# Altium schematic sheet USB_PCIe.SchDoc: USB_PCIe
size A3; Date: Not used; ApprovedBy: Not used; CheckedBy: Not used; Author: Not used; CompanyName: STMicroelectronics; DrawnBy: Not used; Engineer: Not used; Organization: Not used; Address1: Not used; Address2: Not used; Address3: Not used; Address4: Not used; DocumentNumber: Not used; Revision: Not used; SheetNumber: 11; SheetTotal: 18; CurrentTime: Not used; CurrentDate: Not used; Time: Not used; DocumentFullPathAndName: Not used; DocumentName: Not used; ModifiedDate: Not used; ImagePath: Not used; ProjectName: Not used; Application_BuildNumber: Not used
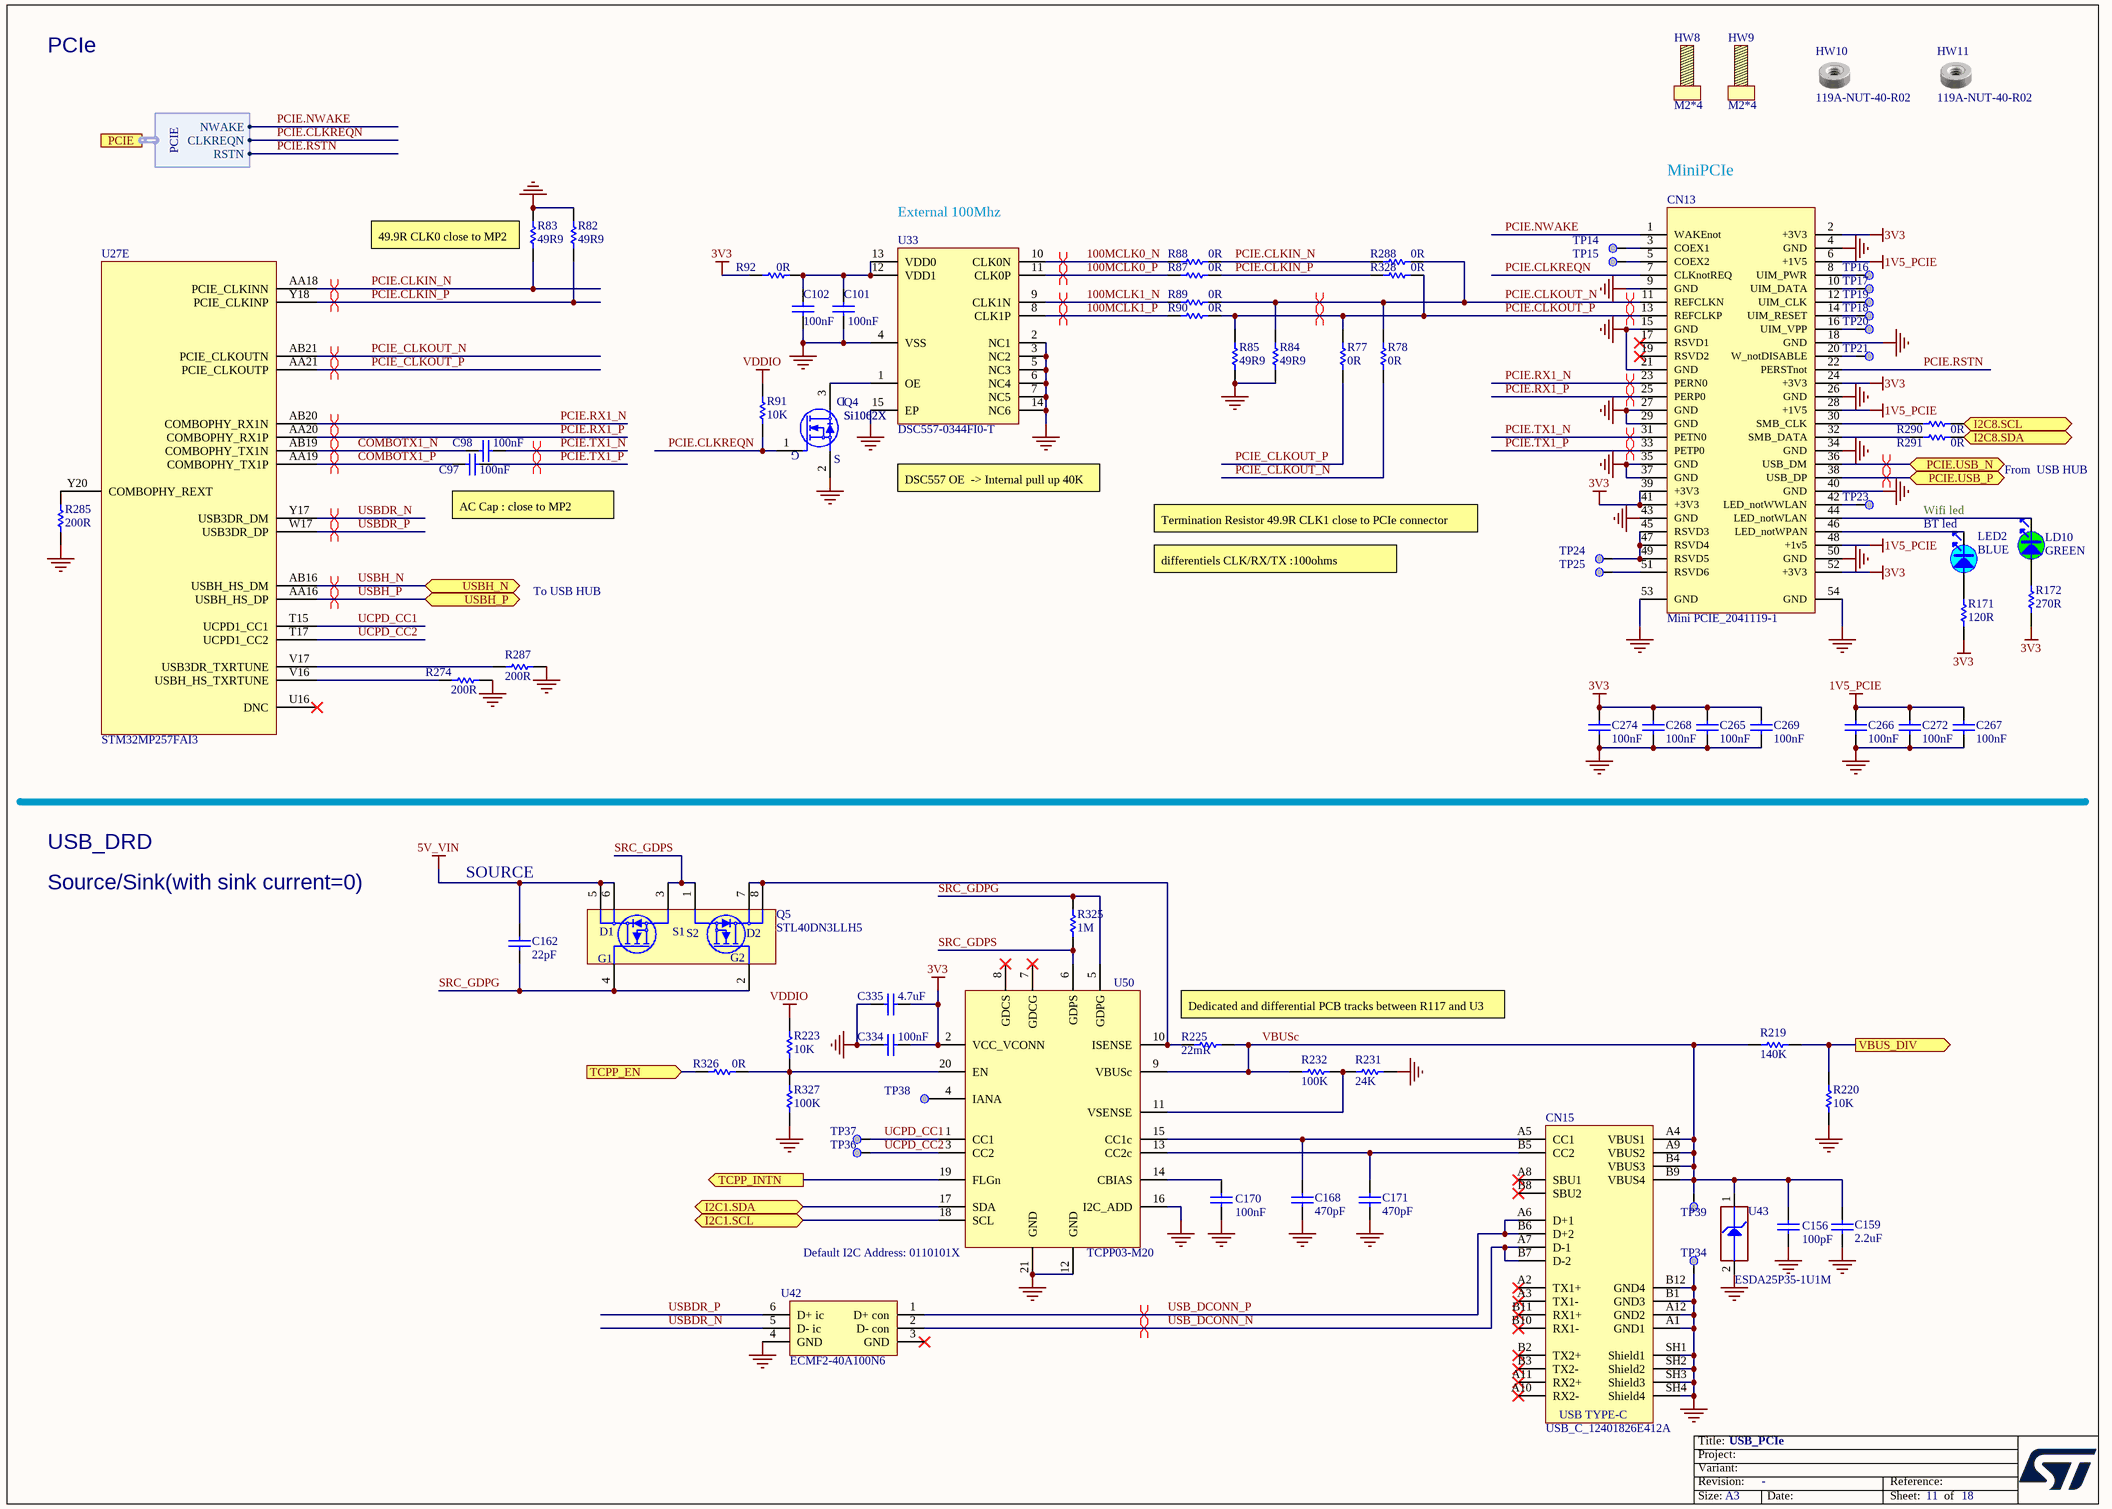
[diagram p0: USB_PCIe.SchDoc]

## Parts
C97  value 100nF  [C0201_MURATA_GRM033_H0P3]  (hidden comment: Capacitor)
C98  value 100nF  [C0201_MURATA_GRM033_H0P3]  (hidden comment: Capacitor)
C101  value 100nF  [C0402]  (hidden comment: Capacitor)
C102  value 100nF  [C0402]  (hidden comment: Capacitor)
C156  value 100pF  [C0402]  (hidden comment: Capacitor)
C159  value 2.2uF  [C0805]  (hidden comment: Capacitor)
C162  value 22pF  [C0402]  (hidden comment: Capacitor)
C168  value 470pF  [C0402]  (hidden comment: Capacitor)
C170  value 100nF  [C0603]  (hidden comment: Capacitor)
C171  value 470pF  [C0402]  (hidden comment: Capacitor)
C265  value 100nF  [C0201_H0P3]  (hidden comment: Capacitor)
C266  value 100nF  [C0201_H0P3]  (hidden comment: Capacitor)
C267  value 100nF  [C0201_H0P3]  (hidden comment: Capacitor)
C268  value 100nF  [C0201_H0P3]  (hidden comment: Capacitor)
C269  value 100nF  [C0201_H0P3]  (hidden comment: Capacitor)
C272  value 100nF  [C0201_H0P3]  (hidden comment: Capacitor)
C274  value 100nF  [C0201_H0P3]  (hidden comment: Capacitor)
C334  value 100nF  [C0402]  (hidden comment: Capacitor)
C335  value 4.7uF  [C0402]  (hidden comment: Capacitor)
CN13  value Mini PCIE_2041119-1  [CON_TE-CONNECTIVITY_2041119-1_HALF-CARD]  (hidden comment: SOCKET_Mini_PCIE)
CN15  value USB_C_12401826E412A  [CON_USB-TYPEC_AMPHENOL_12401826E412A]  (hidden comment: USB_TYPE_C_Receptacle)
HW8  value M2*4  (hidden comment: SCREW)  (mechanical)
HW9  value M2*4  (hidden comment: SCREW)  (mechanical)
HW10  value 119A-NUT-40-R02  [MISC_119A-NUT-40-R02]  (hidden comment: Standoff_mini_PCIE)  (mechanical)
HW11  value 119A-NUT-40-R02  [MISC_119A-NUT-40-R02]  (hidden comment: Standoff_mini_PCIE)  (mechanical)
LD10  value GREEN  [LED_0603_OSRAM_LG-Q396-PS-35_GREEN_1A2K_H0P4]  (hidden comment: LED_green)
LED2  value BLUE  [LED_0603_OSRAM_LB-Q39G-L2OO-35-1_BLUE_1A2K_H0P4]
Q4  value Si1062X  Manufacturer_Part_Number: Si1062X  [MOS_SC89-3L]  (hidden comment: MOSFET_N-CHANNEL)
Q5  STL40DN3LLH5  [PowerFLAT_5x6]
R77  value 0R  [R0402]  (hidden comment: Resistor)
R78  value 0R  [R0402]  (hidden comment: Resistor)
R82  value 49R9  [R0402]  (hidden comment: Resistor)
R83  value 49R9  [R0402]  (hidden comment: Resistor)
R84  value 49R9  [R0402]  (hidden comment: Resistor)
R85  value 49R9  [R0402]  (hidden comment: Resistor)
R87  value 0R  [R0402]  (hidden comment: Resistor)
R88  value 0R  [R0402]  (hidden comment: Resistor)
R89  value 0R  [R0402]  (hidden comment: Resistor)
R90  value 0R  [R0402]  (hidden comment: Resistor)
R91  value 10K  [R0402]  (hidden comment: Resistor)
R92  value 0R  [R0402]  (hidden comment: Resistor)
R171  value 120R  [R0402]
R172  value 270R  [R0402]  (hidden comment: Resistor)
R219  value 140K  [R0402]  (hidden comment: Resistor)
R220  value 10K  [R0402]  (hidden comment: Resistor)
R223  value 10K  [R0402]  (hidden comment: Resistor)
R225  value 22mR  [R0603]  (hidden comment: Resistor)
R231  value 24K  [R0402]  (hidden comment: Resistor)
R232  value 100K  [R0402]  (hidden comment: Resistor)
R274  value 200R  [R0402]  (hidden comment: Resistor)
R285  value 200R  [R0402]  (hidden comment: Resistor)
R287  value 200R  [R0402]  (hidden comment: Resistor)
R288  value 0R  [R0402]  (hidden comment: Resistor)
R290  value 0R  [R0402]  (hidden comment: Resistor)
R291  value 0R  [R0402]  (hidden comment: Resistor)
R325  value 1M  [R0402]  (hidden comment: Resistor)
R326  value 0R  [R0402]  (hidden comment: Resistor)
R327  value 100K  [R0402]  (hidden comment: Resistor)
R328  value 0R  [R0402]  (hidden comment: Resistor)
TP14  Test Point  [TP_SMD_1MM]  (value not drawn)  (no BOM)
TP15  Test Point  [TP_SMD_1MM]  (value not drawn)  (no BOM)
TP16  Test Point  [TP_SMD_1MM]  (value not drawn)  (no BOM)
TP17  Test Point  [TP_SMD_1MM]  (value not drawn)  (no BOM)
TP18  Test Point  [TP_SMD_1MM]  (value not drawn)  (no BOM)
TP19  Test Point  [TP_SMD_1MM]  (value not drawn)  (no BOM)
TP20  Test Point  [TP_SMD_1MM]  (value not drawn)  (no BOM)
TP21  Test Point  [TP_SMD_1MM]  (value not drawn)  (no BOM)
TP23  Test Point  [TP_SMD_1MM]  (value not drawn)  (no BOM)
TP24  Test Point  [TP_SMD_1MM]  (value not drawn)  (no BOM)
TP25  Test Point  [TP_SMD_1MM]  (value not drawn)  (no BOM)
TP34  Test Point  [TP_SMD_1MM]  (value not drawn)  (no BOM)
TP36  Test Point  [TP_SMD_1MM]  (value not drawn)  (no BOM)
TP37  Test Point  [TP_SMD_1MM]  (value not drawn)  (no BOM)
TP38  Test Point  [TP_SMD_1MM]  (value not drawn)  (no BOM)
TP39  Test Point  [TP_SMD_1MM]  (value not drawn)  (no BOM)
U27  STM32MP257FAI3  [ICC_LFBGA436_18X18_P080_H1P70_STM32MP257_CODE-B0D1]  (part E of 9)
U33  DSC557-0344FI0-T  [ICC_QFN14-EPAD_3P2X2P5_P050]
U42  ECMF2-40A100N6  [ESD_UQFN-6L_1P45X1P4_P040]
U43  value ESDA25P35-1U1M  [ESD_QFN1610_2N_1K_2A]  (hidden comment: ESD-TRANSIL)
U50  TCPP03-M20  [ICC_QFN20-EPAD_4X4_P050]

## Ports
I2C1.SCL (bidir), I2C1.SDA (bidir), I2C8.SCL (bidir), I2C8.SDA (bidir), PCIE (harness PCIE), PCIE.USB_N (bidir), PCIE.USB_P (bidir), TCPP_EN (in), TCPP_INTN (out), USBH_N (bidir), USBH_P (bidir), VBUS_DIV (out)

## Harnesses
PCIE: NWAKE, CLKREQN, RSTN

## Nets
1V5_PCIE: C266.1 C267.1 C272.1 CN13.6(+1V5) CN13.28(+1V5) CN13.48(+1v5)
3V3: C265.1 C268.1 C269.2 C274.1 C334.1 C335.1 CN13.2(+3V3) CN13.24(+3V3) CN13.39(+3V3) CN13.41(+3V3) CN13.52(+3V3) R92.1 R171.2 R172.1 U50.2(VCC_VCONN)
5V_VIN: C162.2 Q5.5(D1) Q5.6(D1)
GND: C101.1 C102.1 C156.1 C159.1 C168.1 C170.1 C171.1 C265.2 C266.2 C267.2 C268.2 C269.1 C272.2 C274.2 C334.2 C335.2 CN13.4(GND) CN13.9(GND) CN13.15(GND) CN13.18(GND) CN13.21(GND) CN13.26(GND) CN13.27(GND) CN13.29(GND) CN13.34(GND) CN13.35(GND) CN13.37(GND) CN13.40(GND) CN13.43(GND) CN13.50(GND) CN13.53(GND) CN13.54(GND) CN15.A1(GND1) CN15.A12(GND2) CN15.B1(GND3) CN15.B12(GND4) CN15.SH1(Shield1) CN15.SH2(Shield2) CN15.SH3(Shield3) CN15.SH4(Shield4) Q4.2(S) R82.2 R83.2 R84.1 R85.1 R220.1 R231.2 R274.2 R285.1 R287.2 R327.1 TP34.1 U33.2(NC1) U33.3(NC2) U33.4(VSS) U33.5(NC3) U33.6(NC4) U33.7(NC5) U33.14(NC6) U33.15(EP) U42.4(GND) U43.2(GND) U50.12(GND) U50.16(I2C_ADD) U50.21(GND)
VDDIO: R91.2 R223.2
100MCLK0_N: R88.1 U33.10(CLK0N)
100MCLK0_P: R87.1 U33.11(CLK0P)
100MCLK1_N: R89.1 U33.9(CLK1N)
100MCLK1_P: R90.1 U33.8(CLK1P)
COMBOTX1_N: C98.1 U27.AB19(COMBOPHY_TX1N)
COMBOTX1_P: C97.1 U27.AA19(COMBOPHY_TX1P)
I2C1.SCL: U50.18(SCL) ; port I2C1.SCL
I2C1.SDA: U50.17(SDA) ; port I2C1.SDA
I2C8.SCL: R290.2 ; port I2C8.SCL
I2C8.SDA: R291.2 ; port I2C8.SDA
PCIE.CLKIN_N: R83.1 R88.2 R288.2 U27.AA18(PCIE_CLKINN)
PCIE.CLKIN_P: R82.1 R87.2 R328.2 U27.Y18(PCIE_CLKINP)
PCIE.CLKOUT_N: CN13.11(REFCLKN) R78.2 R84.2 R89.2 R288.1
PCIE.CLKOUT_P: CN13.13(REFCLKP) R77.2 R85.2 R90.2 R328.1
PCIE.CLKREQN: CN13.7(CLKnotREQ) Q4.1(G) R91.1 ; port PCIE.CLKREQN
PCIE.NWAKE: CN13.1(WAKEnot) ; port PCIE.NWAKE
PCIE.RSTN: CN13.22(PERSTnot) ; port PCIE.RSTN
PCIE.RX1_N: CN13.23(PERN0) U27.AB20(COMBOPHY_RX1N)
PCIE.RX1_P: CN13.25(PERP0) U27.AA20(COMBOPHY_RX1P)
PCIE.TX1_N: C98.2 CN13.31(PETN0)
PCIE.TX1_P: C97.2 CN13.33(PETP0)
PCIE.USB_N: CN13.36(USB_DM) ; port PCIE.USB_N
PCIE.USB_P: CN13.38(USB_DP) ; port PCIE.USB_P
PCIE_CLKOUT_N: R78.1 U27.AB21(PCIE_CLKOUTN)
PCIE_CLKOUT_P: R77.1 U27.AA21(PCIE_CLKOUTP)
SRC_GDPG: C162.1 Q5.2(G2) Q5.4(G1) R325.2 U50.5(GDPG)
SRC_GDPS: Q5.1(S2) Q5.3(S1) R325.1 U50.6(GDPS)
TCPP_EN: R326.1 ; port TCPP_EN
TCPP_INTN: U50.19(FLGn) ; port TCPP_INTN
UCPD_CC1: TP37.1 U27.T15(UCPD1_CC1) U50.1(CC1)
UCPD_CC2: TP36.1 U27.T17(UCPD1_CC2) U50.3(CC2)
USB_DCONN_N: CN15.A7(D-1) CN15.B7(D-2) U42.2(D-_con)
USB_DCONN_P: CN15.A6(D+1) CN15.B6(D+2) U42.1(D+_con)
USBDR_N: U27.Y17(USB3DR_DM) U42.5(D-_ic)
USBDR_P: U27.W17(USB3DR_DP) U42.6(D+_ic)
USBH_N: U27.AB16(USBH_HS_DM) ; port USBH_N
USBH_P: U27.AA16(USBH_HS_DP) ; port USBH_P
VBUS_DIV: R219.1 R220.2 ; port VBUS_DIV
VBUSc: C156.2 C159.2 CN15.A4(VBUS1) CN15.A9(VBUS2) CN15.B4(VBUS3) CN15.B9(VBUS4) R219.2 R225.1 R232.1 TP39.1 U43.1(IO1) U50.9(VBUSc)
NetC101_2: C101.2 C102.2 R92.2 U33.12(VDD1) U33.13(VDD0)
NetC168_2: C168.2 CN15.A5(CC1) U50.15(CC1c)
NetC170_2: C170.2 U50.14(CBIAS)
NetC171_2: C171.2 CN15.B5(CC2) U50.13(CC2c)
NetCN13_3: CN13.3(COEX1) TP14.1
NetCN13_5: CN13.5(COEX2) TP15.1
NetCN13_8: CN13.8(UIM_PWR) TP16.1
NetCN13_10: CN13.10(UIM_DATA) TP17.1
NetCN13_12: CN13.12(UIM_CLK) TP19.1
NetCN13_14: CN13.14(UIM_RESET) TP18.1
NetCN13_16: CN13.16(UIM_VPP) TP20.1
NetCN13_20: CN13.20(W_notDISABLE) TP21.1
NetCN13_30: CN13.30(SMB_CLK) R290.1
NetCN13_32: CN13.32(SMB_DATA) R291.1
NetCN13_42: CN13.42(LED_notWWLAN) TP23.1
NetCN13_44: CN13.44(LED_notWLAN) LD10.2
NetCN13_45: CN13.45(RSVD3) CN13.47(RSVD4) CN13.49(RSVD5) TP24.1
NetCN13_46: CN13.46(LED_notWPAN) LED2.2
NetCN13_51: CN13.51(RSVD6) TP25.1
NetLD10_1: LD10.1 R172.2
NetLED2_1: LED2.1 R171.1
NetQ4_3: Q4.3(D) U33.1(OE)
NetQ5_7: Q5.7(D2) Q5.8(D2) R225.2 U50.10(ISENSE)
NetR223_1: R223.1 R326.2 R327.2 U50.20(EN)
NetR231_1: R231.1 R232.2 U50.11(VSENSE)
NetR274_1: R274.1 U27.V16(USBH_HS_TXRTUNE)
NetR285_2: R285.2 U27.Y20(COMBOPHY_REXT)
NetR287_1: R287.1 U27.V17(USB3DR_TXRTUNE)
NetTP38_1: TP38.1 U50.4(IANA)

Not connected (* = marked no-connect by the designer): CN13 17(RSVD1)* 19(RSVD2)*; CN15 A2(TX1+)* A3(TX1-)* A8(SBU1)* A10(RX2-)* A11(RX2+)* B2(TX2+)* B3(TX2-)* B8(SBU2)* B10(RX1-)* B11(RX1+)*; U27 U16(DNC)*; U42 3(GND)*; U50 7(GDCG)* 8(GDCS)*

## Layout directives
differential pair: 100MCLK0_N, 100MCLK0_P, 100MCLK1_N, 100MCLK1_P, COMBOTX1_N, COMBOTX1_P, PCIE.CLKIN_N, PCIE.CLKIN_P, PCIE.CLKOUT_N, PCIE.CLKOUT_P, PCIE.RX1_N, PCIE.RX1_P, PCIE.TX1_N, PCIE.TX1_P, PCIE.USB_N, PCIE.USB_P, PCIE_CLKOUT_N, PCIE_CLKOUT_P, USB_DCONN_N, USB_DCONN_P, USBDR_N, USBDR_P, USBH_N, USBH_P

## Notes on the sheet
- PCIe
- MiniPCIe
- (near R83) 49.9R CLK0 close to MP2
- (near U33) External 100Mhz
- AC Cap : close to MP2
- DSC557 OE  -> Internal pull up 40K
- (near LED2) Wifi led
- From  USB HUB
- differentiels CLK/RX/TX :100ohms
- Termination Resistor 49.9R CLK1 close to PCIe connector
- (near LED2) BT led
- To USB HUB
- USB_DRD
- Source/Sink(with sink current=0)
- SOURCE
- Dedicated and differential PCB tracks between R117 and U3 pin 9 and 10
- (near U50) Default I2C Address: 0110101X
- Title:
- Project:
- Size:
- Revision:
- Variant:
- A3
- -
- Date:
- Reference:
- Sheet:
- of
- (in symbol MCD-03232) USB TYPE-C

## Library data of the parts
C97 C98 = MCD-01535: Capacitor, MLCC,100nF, 10V, X7R, +/-10%, 0201, T=0.3mm; Part_Preference: Recommended; Manufacturer: MURATA; Manufacturer_Part_Number: GRM033R61A104KE15; Order_Code_RS: 790-2742; Component_Country_Of_Origin: Japan; ID: 3635; ShowFields: YES; Internal_Part_Number: MCD-01535; Status: Checked; Part_Type: Capacitor; Package: 0201; ComponentLink1URL: http://tunmcdsvn.tun.st.com/Component_Documentation_Library/Trunk/Capacitor/MURATA_GRM_Series; Order_Code_Digikey: 490-5881-1-ND; Order_Code_Farnell: 2470450
C101 C102 C334 = MCD-00006: Capacitor, MLCC, 100nF, 16V, X7R, +/-10%, 0402, T=0.5mm; Part_Preference: Recommended; Manufacturer: YAGEO; Manufacturer_Part_Number: CC0402KRX7R7BB104; Order_Code_RS: 616-9701; Component_Country_Of_Origin: China; ID: 2474; ShowFields: YES; Internal_Part_Number: MCD-00006; Status: Released; Part_Type: Capacitor; Package: 0402; ComponentLink1URL: http://tunmcdsvn.tun.st.com/Component_Documentation_Library/Trunk/Capacitor/YAGEO_X7R_Series; Order_Code_Digikey: 311-1338-1-ND; Order_Code_Farnell: 9402047
C156 = MCD-00205: Capacitor, MLCC, 100pF, 50V, NPO, +/-5%, 0402, T=0.5mm; Manufacturer_Part_Number: CC0402JRNPO9BN101; Manufacturer: YAGEO; Part_Preference: Recommended; Component_Country_Of_Origin: China; ID: 2658; ShowFields: YES; Internal_Part_Number: MCD-00205; Status: Released; Part_Type: Capacitor; Package: 0402; ComponentLink1URL: http://tunmcdsvn.tun.st.com/Component_Documentation_Library/Trunk/Capacitor/YAGEO_NP0_Series; Order_Code_Digikey: 311-1024-1-ND; Order_Code_Farnell: 3019226RL; Order_Code_RS: N/A
C159 = MCD-02372: Capacitor, MLCC, 2.2uF, 25V, X7R, +/-10%, 0805, T=1,25mm; Part_Preference: Recommended; Manufacturer: MURATA; Manufacturer_Part_Number: GRM21BR71E225KE11L; Component_Country_Of_Origin: Japan; ID: 4478; ShowFields: YES; Internal_Part_Number: MCD-02372; Status: Released; Part_Type: Capacitor; Package: 0805; ComponentLink1URL: http://tunmcdsvn.tun.st.com/Component_Documentation_Library/Trunk/Capacitor/MURATA_GRM_Series/GRM21BR71E225KE11; Order_Code_Digikey: 490-14467; Order_Code_Farnell: 2688538; Order_Code_RS: N/A
C162 = MCD-01995: Capacitor, MLCC, 22pF, 50V, C0G, +/-5%, 0402, T=0.5mm; Part_Preference: Recommended; Manufacturer: TDK; Manufacturer_Part_Number: C1005NP01H220J050BA; Component_Country_Of_Origin: Unknown; ID: 4095; ShowFields: YES; Internal_Part_Number: MCD-01995; Status: Released; Part_Type: Capacitor; Package: 0402; ComponentLink1URL: http://tunmcdsvn.tun.st.com/Component_Documentation_Library/Trunk/Capacitor/TDK_C_Series; Order_Code_Digikey: 445-13793-1-ND; Order_Code_Farnell: 3416050RL; Order_Code_RS: N/A
C168 C171 = MCD-00724: Capacitor, MLCC, 470pF, 50V, NPO, +/-5%, 0402, T=0.5mm; Manufacturer_Part_Number: CC0402JRNPO9BN471; Manufacturer: YAGEO; Part_Preference: Recommended; Component_Country_Of_Origin: China; Order_Code_RS: 199-2186; ID: 3023; ShowFields: YES; Internal_Part_Number: MCD-00724; Status: Released; Part_Type: Capacitor; Package: 0402; ComponentLink1URL: http://tunmcdsvn.tun.st.com/Component_Documentation_Library/Trunk/Capacitor/YAGEO_NP0_Series; Order_Code_Digikey: 311-1671-1-ND; Order_Code_Farnell: 3366416
C170 = MCD-01099: Capacitor, MLCC, 100nF, 50V, X7R, +/-10%, 0603, T=0.8mm; BMS_Part_Number: 9142278; Part_Preference: Recommended; Manufacturer: YAGEO; Manufacturer_Part_Number: CC0603KRX7R9BB104; Order_Code_RS: 669-8767; Component_Country_Of_Origin: China; ID: 3397; ShowFields: YES; Internal_Part_Number: MCD-01099; Status: Released; Part_Type: Capacitor; Package: 0603; ComponentLink1URL: http://tunmcdsvn.tun.st.com/Component_Documentation_Library/Trunk/Capacitor/YAGEO_X7R_Series; Order_Code_Digikey: 311-1344-1-ND; Order_Code_Farnell: 1362556
C265-C269 C272 C274 = MCD-00697: Capacitor, MLCC, 100nF,10V, X5R, +/-10%, 0201, T=0.3mm; Manufacturer_Part_Number: C0603X5R1A104K030BC; Manufacturer: TDK; Part_Preference: Recommended; Component_Country_Of_Origin: Unknown; ID: 3046; ShowFields: YES; Internal_Part_Number: MCD-00697; Status: Released; Part_Type: Capacitor; Package: 0201; ComponentLink1URL: http://tunmcdsvn.tun.st.com/Component_Documentation_Library/Trunk/Capacitor/TDK_MCC_Series; Order_Code_Digikey: 445-7318-1-ND; Order_Code_Farnell: 2524957; Order_Code_RS: N/A
C335 = MCD-01356: Capacitor, MLCC, 4.7uF, 6V3, X5R, +/-20%, 0402, T=0.5mm; Part_Preference: Recommended; Manufacturer: MURATA; Manufacturer_Part_Number: GRM155R60J475ME47; Order_Code_RS: 814-5230; Component_Country_Of_Origin: Japan; ID: 3456; ShowFields: YES; Internal_Part_Number: MCD-01356; Status: Released; Part_Type: Capacitor; Package: 0402; ComponentLink1URL: http://tunmcdsvn.tun.st.com/Component_Documentation_Library/Trunk/Capacitor/MURATA_GRM_Series; Order_Code_Digikey: 490-5915-1-ND; Order_Code_Farnell: 2666407
CN13 = MCD-02227: Socket_Mini PCIE, 52 pins, RA, SMD, T=4mm; Part_Type: Connector; Part_Preference: Recommended; Manufacturer: TE CONNECTIVITY; Manufacturer_Part_Number: 2041119-1; Order_Code_RS: 186-5008; Component_Country_Of_Origin: China; ShowFields: YES; ID: 4327; Internal_Part_Number: MCD-02227; Status: Checked; ComponentLink1URL: http://tunmcdsvn.tun.st.com/Component_Documentation_Library/Trunk/Connector/TE_CONNECTIVITY_2041119_Series/; Order_Code_Digikey: A108265TR-ND; Order_Code_Farnell: 3133832
CN15 = MCD-03232: USB_TypeC, 24 pins, RA, SMD, T=2.96mm; Part_Type: Connector; Part_Preference: Recommended; Manufacturer: AMPHENOL ICC; Manufacturer_Part_Number: 12401826E412A; Component_Country_Of_Origin: China°; ShowFields: YES; ID: 5348; Internal_Part_Number: MCD-03232; Status: Released; ComponentLink1URL: http://tunmcdsvn.tun.st.com/Component_Documentation_Library/Trunk/Connector/AMPHEMOL_ICC_12401826E412A; Order_Code_Digikey: 12401826E412ATR-ND; Order_Code_Farnell: 3727763; Order_Code_RS: N/A
HW8 HW9 = MCD-02934: Screw , M2*4 mm; Part_Type: Accessory; Part_Preference: Recommended; Manufacturer: RS PRO; Manufacturer_Part_Number: 914-1462; ShowFields: YES; ID: 5050; Internal_Part_Number: MCD-02934; Status: New; ComponentLink1URL: http://N/A; Order_Code_Digikey: N/A; Order_Code_Farnell: N/A; Order_Code_RS: 914-1462
HW10 HW11 = MCD-03022: MiniPCIe Stand off , 1.6mm; Part_Type: Mechanical; Part_Preference: Recommended; Manufacturer: ATTEND; ShowFields: YES; ID: 5138; Internal_Part_Number: MCD-03022; Status: Checked; Manufacturer_Part_Number: 119A-NUT-40-R02; ComponentLink1URL: http://tunmcdsvn.tun.st.com/Component_Documentation_Library/Trunk/Mechanical/ATTEND_119A-NUT-40-R02; Order_Code_Digikey: N/A; Order_Code_Farnell: N/A; Order_Code_RS: N/A
LD10 = MCD-00588: LED Green, 0603 SMD, Forward Voltage Typ=2V, Max=2.5V; Part_Type: Display; Manufacturer_Part_Number: LG Q396-PS-35; Manufacturer: OSRAM OPTO SEMICONDUCTORS; Alternate_Manufacturer_Part_Number: VLMTG1300-GS08; Alternate_Manufacturer: VISHAY SEMICONDUCTOR OPTO DIVISION; Alternate_Internal_Part_Number: MCD-02400; Part_Preference: Recommended; Provided_By: SUBCO; Component_Country_Of_Origin: Unknown; ID: 3155; ShowFields: YES; Internal_Part_Number: MCD-00588; Status: Released; Package: LED 0603; ComponentLink1Description: Datasheet; ComponentLink1URL: http://tunmcdsvn.tun.st.com/Component_Datasheet_Library/Trunk/Display/OSRAM_LED_GREEN_LG Q396-PS-35; Order_Code_Digikey: LG Q396-PS-35-ND; ECCN_US: n/a; ECCN_EU: n/a
LED2 = MCD-00585: LED Blue, 0603 SMD, Forward Voltage Min=2,8V, Max=3,8V; Part_Type: Display; Manufacturer_Part_Number: LB Q39G-L2OO-35-1; Manufacturer: OSRAM OPTO SEMICONDUCTORS; Alternate_Manufacturer_Part_Number: 19-217-BHC-ZL1M2RY-3T-V4; Alternate_Manufacturer: EVERLIGHT; Alternate_Internal_Part_Number: MCD-02398; Part_Preference: Recommended; Order_Code_RS: 9148643; Provided_By: SUBCO; Component_Country_Of_Origin: Unknown; ID: 3159; ShowFields: YES; Internal_Part_Number: MCD-00585; Status: Released; Package: LED 0603; ComponentLink1Description: Datasheet; ComponentLink1URL: http://tunmcdsvn.tun.st.com/Component_Datasheet_Library/Trunk/Display/OSRAM_LED_BLUE_LB Q39G-L2OO-35-1; Order_Code_Digikey: 475-2816-1-ND; ECCN_US: n/a; ECCN_EU: n/a
Q4 = MCD-02221: MOSFET N-CH 20V SC-89; Part_Preference: Recommended; Part_Type: Transistor; Manufacturer: VISHAY; Order_Code_RS: 812-3044; Component_Country_Of_Origin: Philippines; ID: 4321; ShowFields: YES; Internal_Part_Number: MCD-02221; Status: Checked; Package: SC-89; ComponentLink1URL: http://tunmcdsvn.tun.st.com/Component_Datasheet_Library/Trunk/Transistors/VISHAY_Si1062X; Order_Code_Digikey: SI1062X-T1-GE3CT-ND; Order_Code_Farnell: 2646363
Q5 = MCD-02152: MOSFET, Dual N-channel 30 V, 0.016 Ω typ., 40 A, STripFET™ H5 Power MOSFET; Part_Preference: Recommended; Part_Type: Transistor; Manufacturer: STMICROELECTRONICS; Manufacturer_HQ_COO: EU; Component_Country_Of_Origin: China; ID: 4252; ShowFields: YES; Internal_Part_Number: MCD-02152; Value: STL40DN3LLH5; Status: Released; Manufacturer_Part_Number: STL40DN3LLH5; Package: PowerFLAT 5x6; ComponentLink1URL: http://tunmcdsvn.tun.st.com/Component_Datasheet_Library/Trunk/Transistors/STMICROELECTRONICS_STL40DN3LLH5; Order_Code_Digikey: N/A; Order_Code_Farnell: N/A; Order_Code_RS: N/A
R77 R78 R87-R90 R92 = MCD-00052: Resistor, 0R, 0402, +/-5%, 1/16W; Part_Preference: Recommended; Manufacturer: YAGEO; Manufacturer_Part_Number: RC0402JR-070RL; Order_Code_RS: 618-5804; Component_Country_Of_Origin: China; ID: 2540; ShowFields: YES; Internal_Part_Number: MCD-00052; Status: Released; Part_Type: Resistor; Package: 0402; ComponentLink1URL: http://tunmcdsvn.tun.st.com/Component_Documentation_Library/Trunk/Resistor/YAGEO_RC_L_Series; Order_Code_Digikey: 311-0.0JRCT-ND; Order_Code_Farnell: 9232516RL
R82-R85 = MCD-00565: Resistor, 49R9, 0402, +/-1%, 1/16W; Part_Preference: Recommended; Manufacturer: YAGEO; Manufacturer_Part_Number: RC0402FR-0749R9L; Component_Country_Of_Origin: China; ID: 3178; ShowFields: YES; Internal_Part_Number: MCD-00565; Status: Released; Part_Type: Resistor; Package: 0402; ComponentLink1URL: http://tunmcdsvn.tun.st.com/Component_Documentation_Library/Trunk/Resistor/YAGEO_RC_L_Series; Order_Code_Digikey: 311-49.9LRCT-ND; Order_Code_Farnell: 1799218; Order_Code_RS: N/A
R91 R220 R223 = MCD-00053: Resistor, 10K, 0402, +/-1%, 1/16W; BMS_Part_Number: 9131590; Part_Preference: Recommended; Manufacturer: YAGEO; Manufacturer_Part_Number: RC0402FR-0710KL; Component_Country_Of_Origin: China; ID: 2539; ShowFields: YES; Internal_Part_Number: MCD-00053; Status: Released; Part_Type: Resistor; Package: 0402; ComponentLink1URL: http://tunmcdsvn.tun.st.com/Component_Documentation_Library/Trunk/Resistor/YAGEO_RC_L_Series; Order_Code_Digikey: 311-10.0KLRCT-ND; Order_Code_Farnell: 9239359; Order_Code_RS: N/A
R171 = MCD-00194: Resistor,120R,0402,1%,1/16W; Manufacturer_Part_Number: RC0402FR-07120RL; Manufacturer: YAGEO; Part_Preference: Recommended; Provided_By: SUBCO; ECCN_US: EAR99; ECCN_EU: NEC; Component_Country_Of_Origin: China; ID: 2674; ShowFields: YES; Internal_Part_Number: MCD-00194; Status: Released; Part_Type: Resistor; Package: 0402; ComponentLink1Description: Datasheet; ComponentLink1URL: http://tunmcdsvn.tun.st.com/Component_Documentation_Library/Trunk/Resistor/YAGEO_RC_L_Series; Order_Code_Digikey: 311-120LRCT-ND; Order_Code_Farnell: 9239120; Order_Code_RS: N/A
R172 = MCD-00441: Resistor,270R,0402,1%,1/16W; Manufacturer_Part_Number: RC0402FR-07270RL; Manufacturer: YAGEO; Part_Preference: Recommended; Provided_By: SUBCO; ECCN_US: EAR99; ECCN_EU: NEC; Component_Country_Of_Origin: China; ID: 2838; ShowFields: YES; Internal_Part_Number: MCD-00441; Status: Released; Part_Type: Resistor; Package: 0402; ComponentLink1Description: Datasheet; ComponentLink1URL: http://tunmcdsvn.tun.st.com/Component_Documentation_Library/Trunk/Resistor/YAGEO_RC_L_Series; Order_Code_Digikey: 311-270LRCT-ND; Order_Code_Farnell: 9239162; Order_Code_RS: N/A
R219 = MCD-02335: Resistor, 140K, 0402, +/-1%, 1/16W; Part_Preference: Recommended; Manufacturer: YAGEO; Manufacturer_Part_Number: RC0402FR-07140KL; Component_Country_Of_Origin: China; ID: 4441; ShowFields: YES; Internal_Part_Number: MCD-02335; Status: Checked; Part_Type: Resistor; Package: 0402; ComponentLink1URL: http://tunmcdsvn.tun.st.com/Component_Documentation_Library/Trunk/Resistor/YAGEO_RC_L_Series; Order_Code_Digikey: YAG2978CT-ND; Order_Code_Farnell: N/A; Order_Code_RS: N/A
R225 = MCD-02232: Resistor, 22mR, 0603, +/-1%, 1/3W; Part_Preference: Recommended; Manufacturer: PANASONIC; Manufacturer_Part_Number: ERJ-3BWFR022V; Order_Code_RS: 763-8671P; Component_Country_Of_Origin: Japan; ID: 4332; ShowFields: YES; Internal_Part_Number: MCD-02232; Status: Checked; Part_Type: Resistor; Package: 0603; ComponentLink1URL: http://tunmcdsvn.tun.st.com/Component_Documentation_Library/Trunk/Resistor/PANASONIC_ERJ_Series; Order_Code_Digikey: P17462CT-ND; Order_Code_Farnell: 1798578
R231 = MCD-00435: Resistor, 24K, 0402, +/-1%, 1/16W; Part_Preference: Recommended; Manufacturer: YAGEO; Manufacturer_Part_Number: RC0402FR-0724KL; Component_Country_Of_Origin: China; ShowFields: YES; ID: 2845; Internal_Part_Number: MCD-00435; Status: Released; Part_Type: Resistor; Package: 0402; ComponentLink1URL: http://tunmcdsvn.tun.st.com/Component_Documentation_Library/Trunk/Resistor/YAGEO_RC_L_Series; Order_Code_Digikey: 311-24KLRCT-ND; Order_Code_Farnell: N/A; Order_Code_RS: N/A
R232 R327 = MCD-02265: Resistor,100K,0402,0.5%,1/16W; Part_Preference: Recommended; Manufacturer: YAGEO; Manufacturer_Part_Number: RC0402DR-07100KL; Component_Country_Of_Origin: China; ShowFields: YES; ID: 4365; Internal_Part_Number: MCD-02265; Status: Released; Part_Type: Resistor; Package: 0402; ComponentLink1URL: http://tunmcdsvn.tun.st.com/Component_Datasheet_Library/Trunk/Resistors/Yageo_Resistor_RC0402-series; Order_Code_Digikey: 13-RC0402DR-07100KLTR-ND; Order_Code_Farnell: N/A; Order_Code_RS: N/A
R274 R285 R287 = MCD-00417: Resistor, 200R, 0402, +/-1%, 1/16W; Part_Preference: Recommended; Manufacturer: YAGEO; Manufacturer_Part_Number: RC0402FR-07200RL; Component_Country_Of_Origin: China; ID: 2860; ShowFields: YES; Internal_Part_Number: MCD-00417; Status: Released; Part_Type: Resistor; Package: 0402; ComponentLink1URL: http://tunmcdsvn.tun.st.com/Component_Documentation_Library/Trunk/Resistor/YAGEO_RC_L_Series; Order_Code_Digikey: 311-200LRCT-ND; Order_Code_Farnell: 1458756; Order_Code_RS: N/A
R288 R328 = MCD-00052: Resistor,0R,0402,5%,1/16W; Part_Preference: Recommended; Manufacturer: YAGEO; Manufacturer_Part_Number: RC0402JR-070RL; Order_Code_RS: 618-5804; Internal_Part_Number: MCD-00052; Status: Released; Part_Type: Resistor; Package: 0402; ComponentLink1Description: Datasheet; ComponentLink1URL: http://tunmcdsvn.tun.st.com/Component_Documentation_Library/Trunk/Resistor/YAGEO_RC_L_Series; Order_Code_Digikey: 311-0.0JRCT-ND; Order_Code_Farnell: 9232516RL; Alternate_Manufacturer: N/A; Alternate_Manufacturer_Part_Number: N/A
R290 R291 = MCD-00052: Resistor, 0R, 0402, +/-5%, 1/16W; Part_Preference: Recommended; Manufacturer: YAGEO; Manufacturer_Part_Number: RC0402JR-070RL; Order_Code_RS: 618-5804; Component_Country_Of_Origin: China; ShowFields: YES; ID: 2540; Internal_Part_Number: MCD-00052; Status: Released; Part_Type: Resistor; Package: 0402; ComponentLink1URL: http://tunmcdsvn.tun.st.com/Component_Documentation_Library/Trunk/Resistor/YAGEO_RC_L_Series; Order_Code_Digikey: 311-0.0JRCT-ND; Order_Code_Farnell: 9232516RL
R325 = MCD-00182: Resistor, 1M, 0402, +/-1%, 1/16W; BMS_Part_Number: 9131778; Part_Preference: Recommended; Manufacturer: YAGEO; Manufacturer_Part_Number: RC0402FR-071ML; Order_Code_RS: 618-6194; Component_Country_Of_Origin: China; ShowFields: YES; ID: 2686; Internal_Part_Number: MCD-00182; Status: Released; Part_Type: Resistor; Package: 0402; ComponentLink1URL: http://tunmcdsvn.tun.st.com/Component_Documentation_Library/Trunk/Resistor/YAGEO_RC_L_Series; Order_Code_Digikey: 311-1.00MLRCT-ND; Order_Code_Farnell: 9239588
R326 = MCD-00052: Resistor,0R,0402,5%,1/16W; Manufacturer_Part_Number: RC0402JR-070RL; Manufacturer: YAGEO; Part_Preference: Recommended; Order_Code_RS: 618-5804; Component_Country_Of_Origin: China; ID: 2540; ShowFields: YES; Internal_Part_Number: MCD-00052; Status: Released; Part_Type: Resistor; ComponentLink1Description: Part_Information; ComponentLink1URL: http://tunmcdsvn.tun.st.com/Component_Documentation_Library/Trunk/Resistor/YAGEO_RC_L_Series; Package: 0402; Order_Code_Digikey: 311-0.0JRCT-ND; Order_Code_Farnell: 9232516RL; Alternate_Manufacturer: N/A; Alternate_Manufacturer_Part_Number: N/A
TP14-TP21 TP23-TP25 TP34 TP36-TP39 = MCD-00074: Test Point 1mm; Part_Type: Misc; Part_Preference: Recommended; ID: 2518; ShowFields: YES; Internal_Part_Number: MCD-00074; Status: Released; Manufacturer_Part_Number: n/a; ComponentLink1URL: http://na; Order_Code_Digikey: N/A; Order_Code_Farnell: N/A; Order_Code_RS: N/A
  TP14-TP21 TP23-TP25: Manufacturer: n/a
  TP34 TP36-TP39: Manufacturer: N/A
U27 = MCD-02000: MPU, ARM Cortex-A35 + M33 32-bit MPU, 808KB RAM, With Crypto; Part_Type: IC; Part_Preference: Recommended; Manufacturer: STMICROELECTRONICS; Manufacturer_HQ_COO: EU; Component_Country_Of_Origin: Unknown; ShowFields: YES; ID: 4100; Internal_Part_Number: MCD-02000; Value: STM32MP257FAI3; Status: Checked; Manufacturer_Part_Number: STM32MP257FAI3; Package: LFBGA-436; ComponentLink1URL: http://tunmcdsvn.tun.st.com/Component_Documentation_Library/Trunk/IC/STMICROELECTRONICS_STM32MP257FAI3; Order_Code_Digikey: N/A; Order_Code_Farnell: N/A; Order_Code_RS: N/A
U33 = MCD-02349: Crystal-less Two Output PCIe Gen1/2/3 Clock Generator 100Mhz , 2.25V to 3.6V, 100ppm; Part_Type: IC; Part_Preference: Recommended; Manufacturer: MICROCHIP; Component_Country_Of_Origin: Unknown; ID: 4455; ShowFields: YES; ComponentLink1Description: Datasheet; ComponentLink1URL: http://tunmcdsvn.tun.st.com/Component_Documentation_Library/Trunk/IC/MICROCHIP_DSC557-0344FI0-T/; Internal_Part_Number: MCD-02349; Value: DSC557-0344FI0-T; Status: Checked; Manufacturer_Part_Number: DSC557-0344FI0-T; Package: 14 QFN; Order_Code_Digikey: DSC557-0344FI0TTR-ND; Order_Code_Farnell: N/A; Order_Code_RS: N/A
U42 = MCD-03060: ESD protection & Common Filter High Speed serial Interfaces , 0.4 pitch; Part_Type: IC; Part_Preference: Recommended; Manufacturer: STMICROELECTRONICS; ShowFields: YES; ID: 5176; Component_Country_Of_Origin: China; ComponentLink1Description: Datasheet; ComponentLink1URL: http://tunmcdsvn.tun.st.com/Component_Documentation_Library/Trunk/IC/STMICROELECTRONICS_ECMF4-40A100N10; Internal_Part_Number: MCD-03060; Value: ECMF2-40A100N6; Status: Checked; Manufacturer_Part_Number: ECMF2-40A100N6; Package: uQFN-6; Order_Code_Digikey: 497-ECMF2-40A100N6; Order_Code_Farnell: 3993603; Order_Code_RS: N/A
U43 = MCD-01207: High power Transient voltage suppressor:25V/35A EOS and ESD transients protection.; BMS_Part_Number: 9179045; Part_Type: Diode; Part_Preference: Recommended; Manufacturer: STMICROELECTRONICS; Manufacturer_HQ_COO: EU; Component_Country_Of_Origin: China; ID: 3289; ShowFields: YES; Internal_Part_Number: MCD-01207; Status: Released; Manufacturer_Part_Number: ESDA25P35-1U1M; Package: QFN1610; ComponentLink1URL: http://tunmcdsvn.tun.st.com/Component_Datasheet_Library/Trunk/Diodes/STM_ESD_ESDA25P35-1U1M
U50 = MCD-02130: USB Type-C Port Protection for USB DRP Power Delivery, PPS compliant; Part_Preference: Recommended; Part_Type: IC; Manufacturer: STMICROELECTRONICS; Manufacturer_HQ_COO: EU; Component_Country_Of_Origin: Unknown; ID: 4230; ShowFields: YES; Internal_Part_Number: MCD-02130; Value: TCPP03-M20; Status: Released; Manufacturer_Part_Number: TCPP03-M20; Package: QFN-20L; ComponentLink1URL: http://tunmcdsvn.tun.st.com/Component_Documentation_Library/Trunk/IC/STMICROELECTRONICS_TCPP03-M20; Order_Code_Digikey: N/A; Order_Code_Farnell: N/A; Order_Code_RS: N/A